# EAGLE schematic ATX_power_supply_schematics (EAGLE 9.6.2)
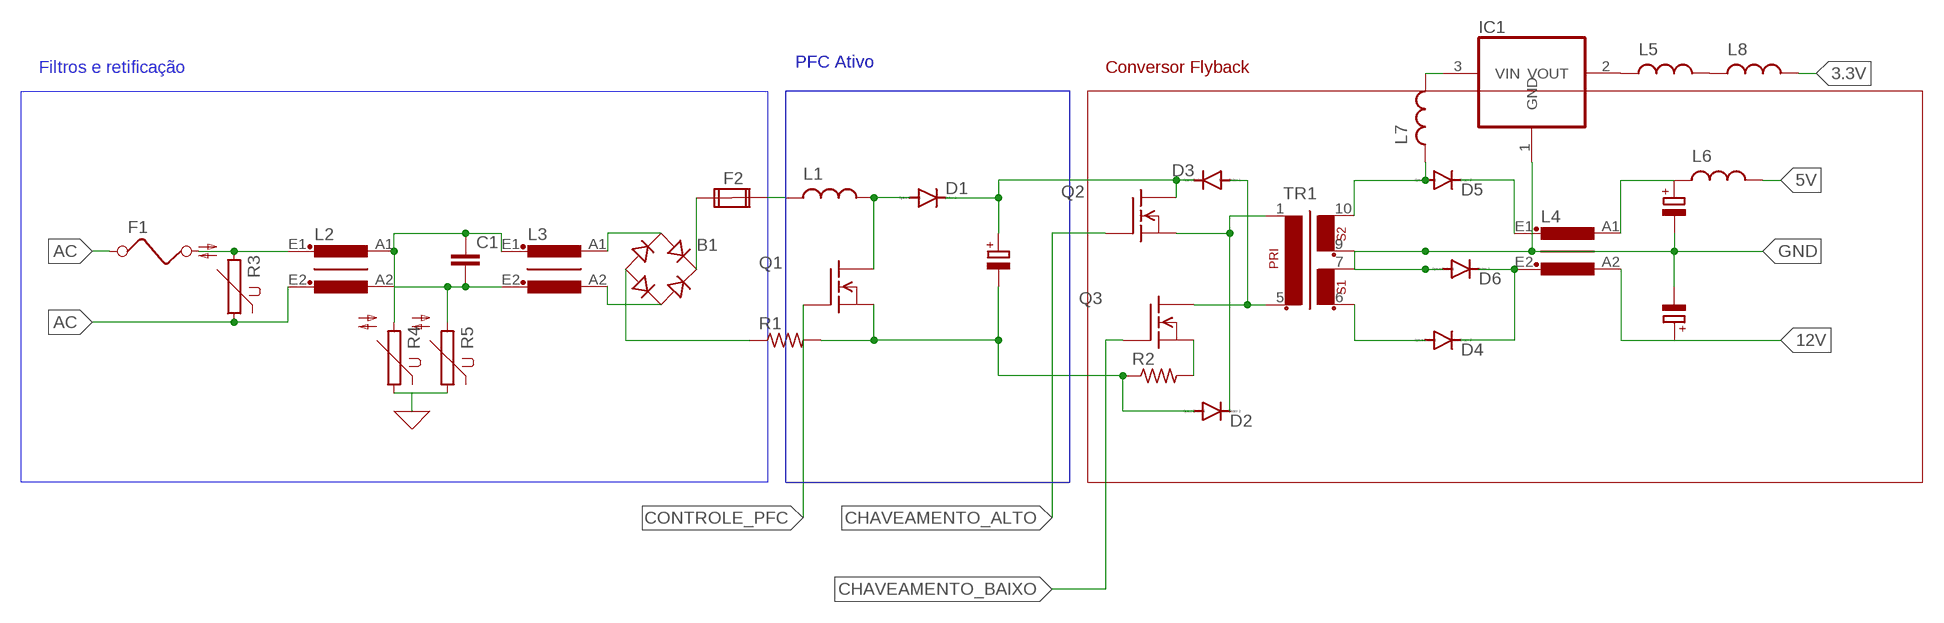
[diagram p0: schematic, sheet 1]

## Parts
B1  DBDB101G  [DB]
C1  C2,5-3  [C2.5-3]
D1  1N4004  [DO41-10]
D2  1N4004  [DO41-10]
D3  1N4004  [DO41-10]
D4  1N4004  [DO41-10]
D5  1N4004  [DO41-10]
D6  1N4004  [DO41-10]
F1  FUSE  [FUSE]
F2  FUSE2P  [FUSE1]
IC1  REG1117F  [DD-3]
L1  L  (no package)
L2  RKZ4  [RKZ4]
L3  RKZ4  [RKZ4]
L4  RKZ4  [RKZ4]
L5  L  (no package)
L6  L  (no package)
L7  L  (no package)
L8  L  (no package)
Q1  BSS101  [TO92]
Q2  BSS101  [TO92]
Q3  BSS101  [TO92]
R1  R-US_0204/2V  [0204V]
R2  R-US_0204/2V  [0204V]
R3  P592  [P592]
R4  P592  [P592]
R5  P592  [P592]
TR1  EI38-2  [EI38-2]

## Nets
3.3V: L8.2
5V: L6.2
12V: L4.A2(W2E)
AC: F1.1 L2.E2(W2A) R3.1
CHAVEAMENTO_ALTO: Q2.2(G)
CONTROLE_PFC: Q1.2(G)
GND: D6.A IC1.1(GND) TR1.7 TR1.9
N$1: C1.1 L3.E1(W1A)
N$2: C1.2 L2.A2(W2E) L3.E2(W2A) R5.2
N$3: F1.2 L2.E1(W1A) R3.2
N$4: R4.1 R5.1
N$5: L2.A1(W1E) R4.2
N$6: B1.AC1 L3.A1(W1E)
N$7: B1.AC2 L3.A2(W2E)
N$8: B1.+ F2.1A
N$9: B1.- R1.1
N$10: F2.2A L1.1
N$11: D1.A L1.2 Q1.3(D)
N$12: Q3.1(S) R2.2
N$13: Q3.2(G)
N$14: IC1.3(VIN) L7.2
N$15: D2.C Q2.1(S) TR1.1
N$16: D4.A TR1.6
N$17: D2.A Q1.1(S) R1.2 R2.1
N$18: D3.A Q3.3(D) TR1.5
N$19: D1.C D3.C Q2.3(D)
N$20: D5.A L7.1 TR1.10
N$21: D5.C L4.E1(W1A)
N$23: L4.A1(W1E) L6.1
N$24: D4.C D6.C L4.E2(W2A)
N$25: IC1.2(VOUT) L5.1
N$26: L5.2 L8.1
Unconnected: F2.1B F2.2B

## Buses
B$1

## Notes on the sheet
- PFC Ativo
- Filtros e retificação | Conversor Flyback

## Library data of the parts
B1 = rectifier:DB?*G: Single Phase 1.0 AMP Glass Passivated Bridge Rectifier Taiwan Semiconductor Co.,Ltd. - TSC Source: http://www.taiwansemi.com/TSCbig5/ezcatfiles/cust/img/img/db101g.pdf http://www.ts.com.tw/db/pictures/modules/PDT/PDT060207001/DBLS201G.pdf
C1 = capacitor-wima:C: CAPACITOR naming: grid - package width
D1-D6 = diode:1N4004: DIODE general purpose rectifier, 1 A
F1 = special:FUSE: FUSE 5 x 20 mm
F2 = special:FUSE2P: FUSE 5 x 20 mm
IC1 = burr-brown:REG1117: 800mA and 1A Low Dropout (LDO) Positive Regulator 1.8V, 2.5V, 2.85V, 3.3V, 5V, and Adj; MF: TEXAS INSTRUMENTS; MPN: REG1117FAKTTT; OC_FARNELL: 1296120; OC_NEWARK: 87H2562
L1 L5-L8 = ngspice-simulation:L: INDUCTOR
L2-L4 = inductors:RKZ4: FILTER
Q1-Q3 = transistor-fet:BSS101: N-Channel Enhancement MOSFET 200V; 0,16A; 11Ohm
R1 R2 = rcl:R-US_: RESISTOR, American symbol; SPICEPREFIX: R
R3-R5 = varistor:P592: VARISTOR
TR1 = trafo:EI38-2: TRANSFORMER 1 primary winding, 2 secondary windings ERA